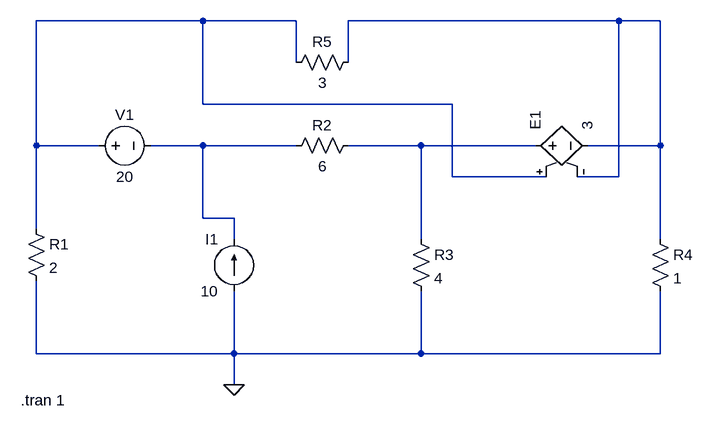
[diagram p0: schematic Ex_03_81.asc]
Ex_03_81.asc, the LTspice schematic file:
Version 4.1
SHEET 1 880 680
WIRE -32 -112 -288 -112
WIRE 112 -112 -32 -112
WIRE 608 -112 192 -112
WIRE 672 -112 608 -112
WIRE 112 -48 112 -112
WIRE 192 -48 192 -112
WIRE -32 16 -32 -112
WIRE 352 16 -32 16
WIRE -288 80 -288 -112
WIRE -192 80 -288 80
WIRE -32 80 -112 80
WIRE 112 80 -32 80
WIRE 304 80 192 80
WIRE 480 80 304 80
WIRE 672 80 672 -112
WIRE 672 80 560 80
WIRE 352 128 352 16
WIRE 496 128 352 128
WIRE 608 128 608 -112
WIRE 608 128 544 128
WIRE -32 192 -32 80
WIRE 16 192 -32 192
WIRE -288 208 -288 80
WIRE 16 224 16 192
WIRE 304 224 304 80
WIRE 672 224 672 80
WIRE -288 400 -288 288
WIRE 16 400 16 304
WIRE 16 400 -288 400
WIRE 304 400 304 304
WIRE 304 400 16 400
WIRE 672 400 672 304
WIRE 672 400 304 400
WIRE 16 448 16 400
FLAG 16 448 0
SYMBOL voltage -208 80 R270
WINDOW 0 32 56 VTop 2
WINDOW 3 -32 56 VBottom 2
WINDOW 123 0 0 Left 0
WINDOW 39 0 0 Left 0
SYMATTR InstName V1
SYMATTR Value 20
SYMBOL current 16 304 R180
WINDOW 0 24 80 Left 2
WINDOW 3 24 0 Left 2
WINDOW 123 0 0 Left 0
WINDOW 39 0 0 Left 0
SYMATTR InstName I1
SYMATTR Value 10
SYMBOL res -304 192 R0
SYMATTR InstName R1
SYMATTR Value 2
SYMBOL res 208 64 R90
WINDOW 0 0 56 VBottom 2
WINDOW 3 32 56 VTop 2
SYMATTR InstName R2
SYMATTR Value 6
SYMBOL res 288 208 R0
SYMATTR InstName R3
SYMATTR Value 4
SYMBOL res 656 208 R0
SYMATTR InstName R4
SYMATTR Value 1
SYMBOL res 96 -32 R270
WINDOW 0 32 56 VTop 2
WINDOW 3 0 56 VBottom 2
SYMATTR InstName R5
SYMATTR Value 3
SYMBOL e 464 80 R270
SYMATTR InstName E1
SYMATTR Value 3
TEXT -312 472 Left 2 !.tran 1

The netlist it stands for:
* Ex_03_81.asc
V1 N001 N003 20
I1 0 N003 10
R1 N001 0 2
R2 N004 N003 6
R3 N004 0 4
R4 N002 0 1
R5 N001 N002 3
E1 N004 N002 N001 N002 3
.tran 1
.backanno
.end